# EAGLE schematic smash (EAGLE 6.3)

## Sheet 1 of 2
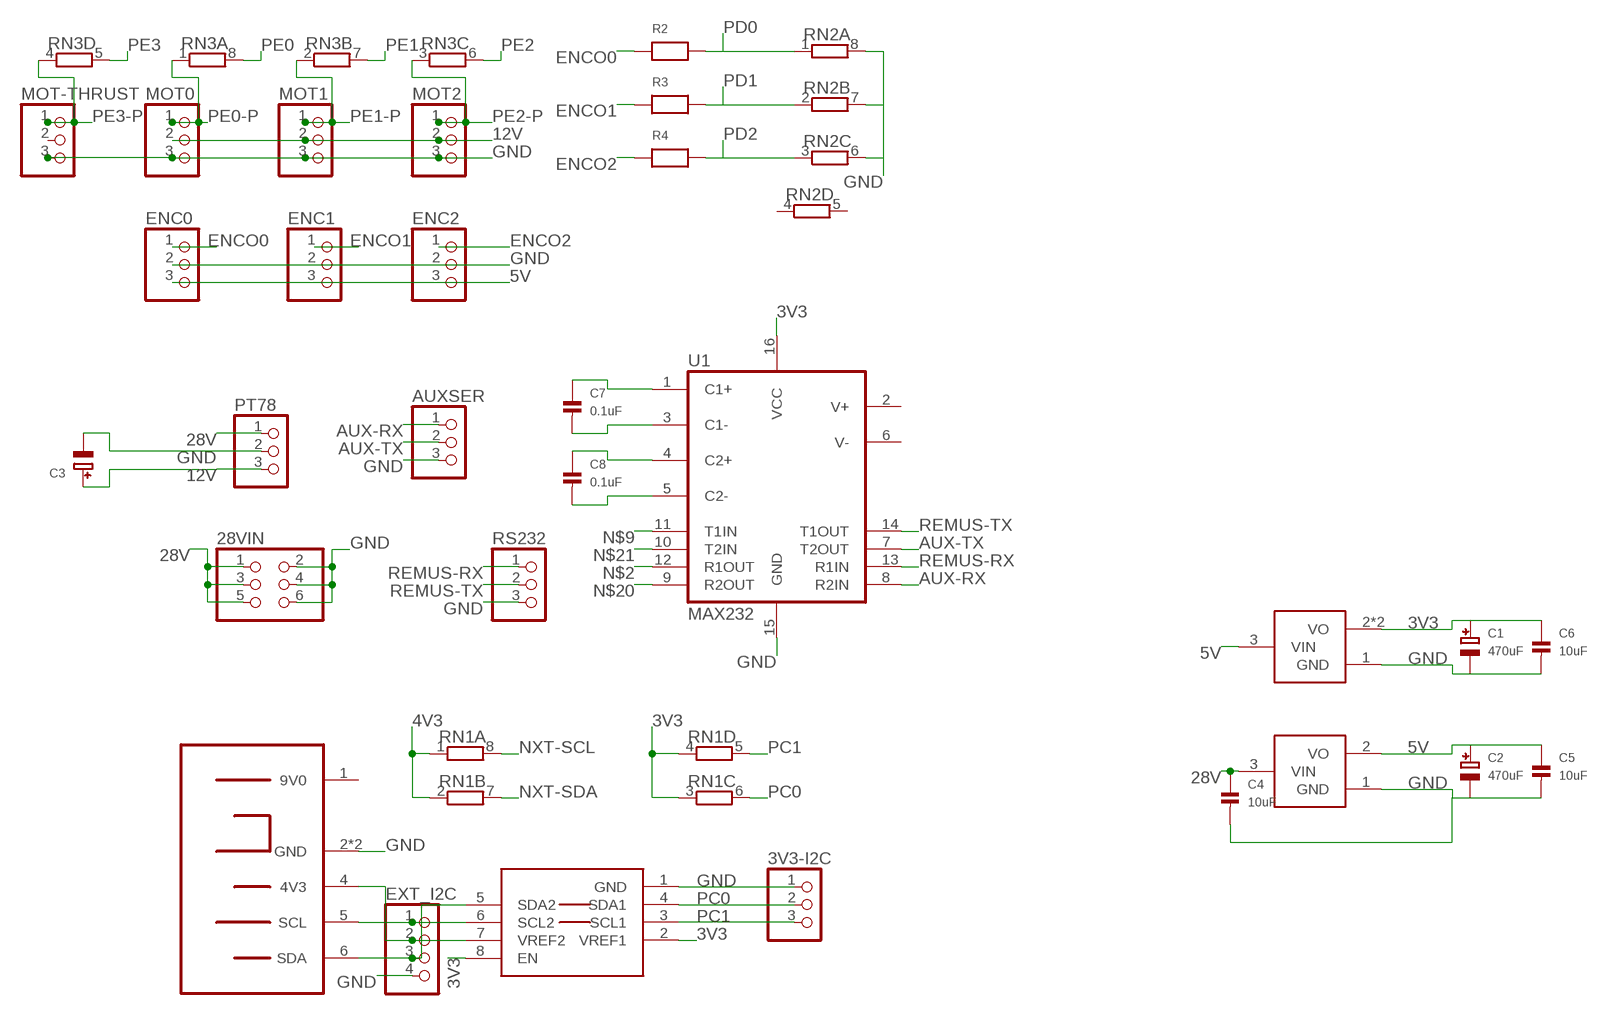
[diagram p0: schematic, sheet 1]

### Parts
3V3-I2C  HEADER-1X3ROUND  [1X03_ROUND]
28VIN  HEADER-2X3  [2X03]
AUXSER  HEADER-1X3ROUND  [1X03_ROUND]
C1  470uF  CAP_TANTALUMD/7343_WAVE  [EIA7343-31/D-W]
C2  470uF  CAP_TANTALUMD/7343_WAVE  [EIA7343-31/D-W]
C3  CAP_TANTALUMD/7343_WAVE  [EIA7343-31/D-W]
C4  10uF  CAP_CERAMIC1206  [1206]
C5  10uF  CAP_CERAMIC1206  [1206]
C6  10uF  CAP_CERAMIC1206  [1206]
C7  0.1uF  CAP_CERAMIC0603  [0603]
C8  0.1uF  CAP_CERAMIC0603  [0603]
ENC0  HEADER-1X3ROUND  [1X03_ROUND]
ENC1  HEADER-1X3ROUND  [1X03_ROUND]
ENC2  HEADER-1X3ROUND  [1X03_ROUND]
EXT_I2C  HEADER-1X4ROUND  [1X04_ROUND]
MOT0  HEADER-1X3ROUND  [1X03_ROUND]
MOT1  HEADER-1X3ROUND  [1X03_ROUND]
MOT2  HEADER-1X3ROUND  [1X03_ROUND]
MOT-THRUST  HEADER-1X3ROUND  [1X03_ROUND]
PT78  HEADER-1X3ROUND  [1X03_ROUND]
R2  RESISTOR0603  [0603]
R3  RESISTOR0603  [0603]
R4  RESISTOR0603  [0603]
RN1  RNETWORK  [RN8P-4R-CRA06S]
RN2  RNETWORK  [RN8P-4R-CRA06S]
RN3  RNETWORK  [RN8P-4R-CRA06S]
RS232  HEADER-1X3ROUND  [1X03_ROUND]
U1  MAX232  [SO-16]
U$1  PCA9306  [SO-08]
U$2  NXT-CONNECTOR  [NXT-FOOTPRINT]
U$3  VREGAP1117  [SOT223]
U$4  VREGIFX27001  [TO252]

### Nets
3V3: C1.+ C6.1 RN1.3 RN1.4 U1.16(VCC) U$1.2(VREF1) U$1.8(EN) U$3.2(VO) U$3.4(VO) ; also sheet 2
4V3: EXT_I2C.2 RN1.1 RN1.2 U$1.7(VREF2) U$2.4(4V3)
5V: C2.+ C5.1 ENC0.3 ENC1.3 ENC2.3 U$3.3(VIN) U$4.2(VO) ; also sheet 2
12V: C3.+ MOT0.2 MOT1.2 MOT2.2 PT78.3
28V: 28VIN.1 28VIN.3 28VIN.5 C4.1 PT78.1 U$4.3(VIN)
AUX-RX: AUXSER.1 U1.8(R2IN)
AUX-TX: AUXSER.2 U1.7(T2OUT)
C1+: C7.1 U1.1(C1+)
C1-: C7.2 U1.3(C1-)
C2+: C8.1 U1.4(C2+)
C2-: C8.2 U1.5(C2-)
ENCO0: ENC0.1 R2.1
ENCO1: ENC1.1 R3.1
ENCO2: ENC2.1 R4.1
GND: 3V3-I2C.1 28VIN.2 28VIN.4 28VIN.6 AUXSER.3 C1.- C3.- C4.2 C5.2 C6.2 ENC0.2 ENC1.2 ENC2.2 EXT_I2C.4 MOT0.3 MOT1.3 MOT2.3 MOT-THRUST.3 PT78.2 RN2.6 RN2.7 RN2.8 RS232.3 U1.15(GND) U$1.1(GND) U$2.2(GND) U$2.3(GND) U$3.1(GND) U$4.1(GND) ; also sheet 2
N$2: U1.12(R1OUT)
N$9: U1.11(T1IN)
N$20: U1.9(R2OUT)
N$21: U1.10(T2IN)
NXT-SCL: EXT_I2C.1 RN1.8 U$1.6(SCL2) U$2.5(SCL)
NXT-SDA: EXT_I2C.3 RN1.7 U$1.5(SDA2) U$2.6(SDA)
PC0: 3V3-I2C.2 RN1.6 U$1.4(SDA1) ; also sheet 2
PC1: 3V3-I2C.3 RN1.5 U$1.3(SCL1) ; also sheet 2
PD0: R2.2 RN2.1 ; also sheet 2
PD1: R3.2 RN2.2 ; also sheet 2
PD2: R4.2 RN2.3 ; also sheet 2
PE0: RN3.8 ; also sheet 2
PE0-P: MOT0.1 RN3.1
PE1: RN3.7 ; also sheet 2
PE1-P: MOT1.1 RN3.2
PE2: RN3.6 ; also sheet 2
PE2-P: MOT2.1 RN3.3
PE3: RN3.5 ; also sheet 2
PE3-P: MOT-THRUST.1 RN3.4
REMUS-RX: RS232.1 U1.13(R1IN)
REMUS-TX: RS232.2 U1.14(T1OUT)
Unconnected: C2.- MOT-THRUST.2 RN2.4 RN2.5 U1.2(V+) U1.6(V-) U$2.1(9V0)

## Sheet 2 of 2
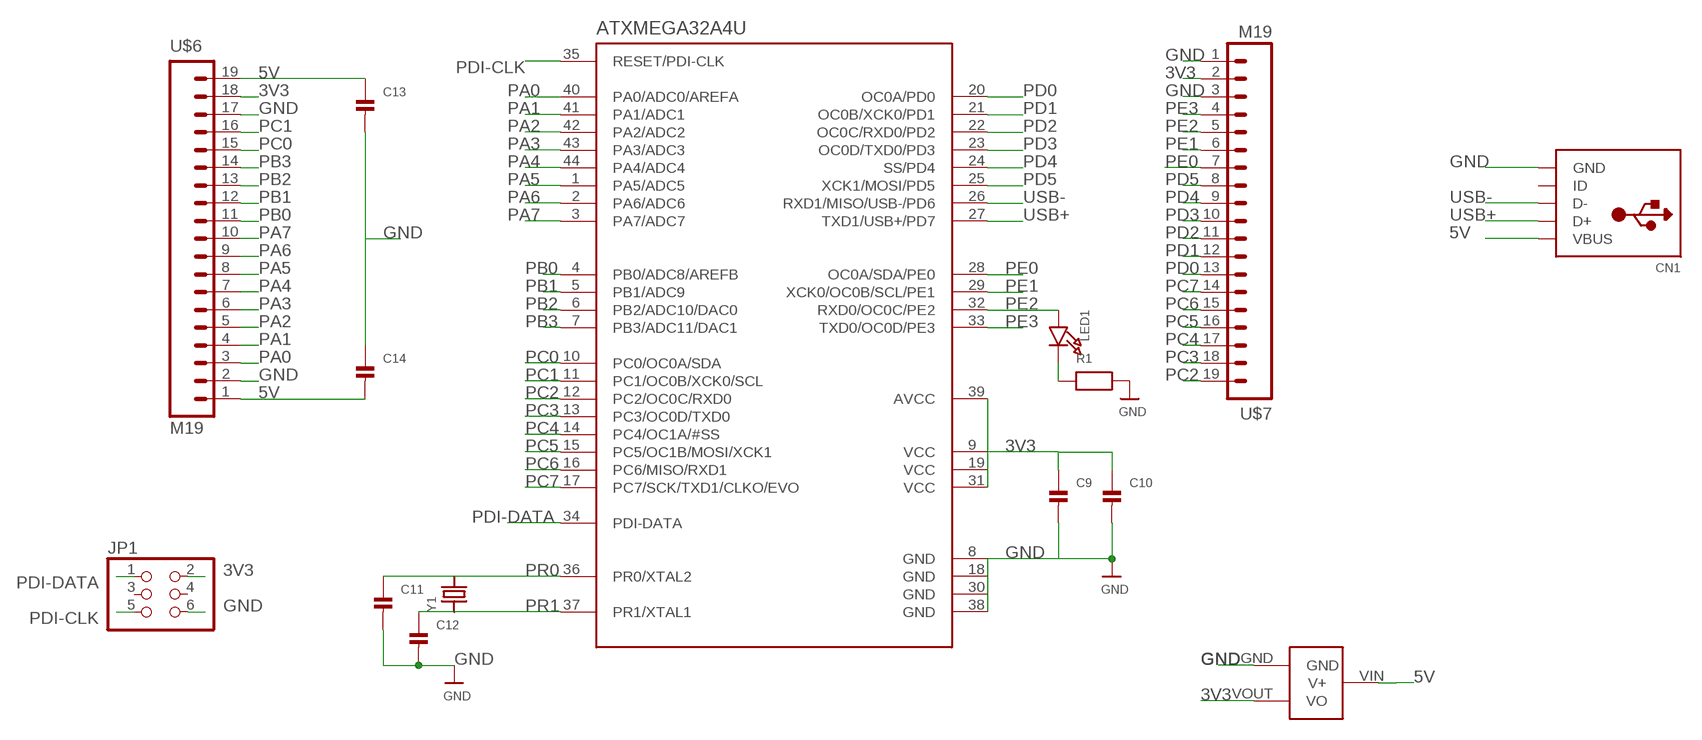
[diagram p1: schematic, sheet 2]

### Parts
ATXMEGA32A4U  ATXMEGAXXA4U-AU  [TQFP-44]
C9  CAP_CERAMIC0603  [0603]
C10  CAP_CERAMIC0603  [0603]
C11  CAP_CERAMIC0603  [0603]
C12  CAP_CERAMIC0603  [0603]
C13  CAP_CERAMIC0603  [0603]
C14  CAP_CERAMIC0603  [0603]
CN1  USBMICROB  [USB-MICROB]
JP1  HEADER-2X3  [2X03]
LED1  LED0603  [CHIPLED_0603]
R1  RESISTOR0603  [0603]
U$5  MCP1700  [SOT23-3]
U$6  M19  [1X19]
U$7  M19  [1X19]
Y1  CRYSTAL  [NX8045GB]

### Nets
3V3: ATXMEGA32A4U.9(VCC) ATXMEGA32A4U.19(VCC) ATXMEGA32A4U.31(VCC) ATXMEGA32A4U.39(AVCC) C9.1 C10.1 JP1.2 U$5.VOUT(VO) U$6.18 U$7.2 ; also sheet 1
5V: C13.1 C14.2 CN1.P1(VBUS) U$5.VIN(V+) U$6.1 U$6.19 ; also sheet 1
GND: ATXMEGA32A4U.8(GND) ATXMEGA32A4U.18(GND) ATXMEGA32A4U.30(GND) ATXMEGA32A4U.38(GND) C9.2 C10.2 C11.2 C12.2 C13.2 C14.1 CN1.P5(GND) JP1.6 R1.2 U$5.GND U$6.2 U$6.17 U$7.1 U$7.3 ; also sheet 1
N$6: LED1.C R1.1
PA0: ATXMEGA32A4U.40(PA0/ADC0/AREFA) U$6.3
PA1: ATXMEGA32A4U.41(PA1/ADC1) U$6.4
PA2: ATXMEGA32A4U.42(PA2/ADC2) U$6.5
PA3: ATXMEGA32A4U.43(PA3/ADC3) U$6.6
PA4: ATXMEGA32A4U.44(PA4/ADC4) U$6.7
PA5: ATXMEGA32A4U.1(PA5/ADC5) U$6.8
PA6: ATXMEGA32A4U.2(PA6/ADC6) U$6.9
PA7: ATXMEGA32A4U.3(PA7/ADC7) U$6.10
PB0: ATXMEGA32A4U.4(PB0/ADC8/AREFB) U$6.11
PB1: ATXMEGA32A4U.5(PB1/ADC9) U$6.12
PB2: ATXMEGA32A4U.6(PB2/ADC10/DAC0) U$6.13
PB3: ATXMEGA32A4U.7(PB3/ADC11/DAC1) U$6.14
PC0: ATXMEGA32A4U.10(PC0/OC0A/SDA) U$6.15 ; also sheet 1
PC1: ATXMEGA32A4U.11(PC1/OC0B/XCK0/SCL) U$6.16 ; also sheet 1
PC2: ATXMEGA32A4U.12(PC2/OC0C/RXD0) U$7.19
PC3: ATXMEGA32A4U.13(PC3/OC0D/TXD0) U$7.18
PC4: ATXMEGA32A4U.14(PC4/OC1A/#SS) U$7.17
PC5: ATXMEGA32A4U.15(PC5/OC1B/MOSI/XCK1) U$7.16
PC6: ATXMEGA32A4U.16(PC6/MISO/RXD1) U$7.15
PC7: ATXMEGA32A4U.17(PC7/SCK/TXD1/CLKO/EVO) U$7.14
PD0: ATXMEGA32A4U.20(OC0A/PD0) U$7.13 ; also sheet 1
PD1: ATXMEGA32A4U.21(OC0B/XCK0/PD1) U$7.12 ; also sheet 1
PD2: ATXMEGA32A4U.22(OC0C/RXD0/PD2) U$7.11 ; also sheet 1
PD3: ATXMEGA32A4U.23(OC0D/TXD0/PD3) U$7.10
PD4: ATXMEGA32A4U.24(SS/PD4) U$7.9
PD5: ATXMEGA32A4U.25(XCK1/MOSI/PD5) U$7.8
PDI-CLK: ATXMEGA32A4U.35(RESET/PDI-CLK) JP1.5
PDI-DATA: ATXMEGA32A4U.34(PDI-DATA) JP1.1
PE0: ATXMEGA32A4U.28(OC0A/SDA/PE0) U$7.7 ; also sheet 1
PE1: ATXMEGA32A4U.29(XCK0/OC0B/SCL/PE1) U$7.6 ; also sheet 1
PE2: ATXMEGA32A4U.32(RXD0/OC0C/PE2) LED1.A U$7.5 ; also sheet 1
PE3: ATXMEGA32A4U.33(TXD0/OC0D/PE3) U$7.4 ; also sheet 1
PR0: ATXMEGA32A4U.36(PR0/XTAL2) C11.1 Y1.P$2
PR1: ATXMEGA32A4U.37(PR1/XTAL1) C12.1 Y1.P$1
USB+: ATXMEGA32A4U.27(TXD1/USB+/PD7) CN1.P3(D+)
USB-: ATXMEGA32A4U.26(RXD1/MISO/USB-/PD6) CN1.P2(D-)
Unconnected: CN1.P4(ID) JP1.3 JP1.4

## Library data of the parts
3V3-I2C AUXSER ENC0 ENC1 ENC2 MOT0 MOT1 MOT2 MOT-THRUST PT78 RS232 = nonolith:HEADER-1X3: PIN HEADER
28VIN JP1 = nonolith:HEADER-2X3: PIN HEADER
ATXMEGA32A4U = nonolith:ATXMEGAXXA4U: ATXMEGA A4U Series (XMEGA+USB)
C1-C3 = microbuilder:CAP_TANTALUM: Tantalum Capacitors Wave footprints have larger pads and are meant to be used for hand soldering. Reflow footprints are optimised for solder paste and a reflow oven. EIA3216-18/A-[R/W] - Size A / 3216-18 / 1206 footprint 4.7µF 25V 10% Tantalum Capacitor 10µF 16V 10% Tantalum Capacitor [Digikey: 495-2236-2-ND] EIA3528-21/B-[R/W] - Size B / 3528-21 47µF 10V 10% Tantalum Capactior [Digikey: 495-2216-1-ND] EIA6032-28/C-[R/W] - Size C / 6032-28 10µF 35V 20% Tantalum Capacitor [Digikey: 495-2285-1-ND] 100µF 16V 10% Tantalum Capactior [Digikey: 399-5214-1-ND]
C4-C14 = nonolith:CAP_CERAMIC: Ceramic Capacitors 0402 - 0402 Surface Mount Capacitors 0.1uF 10V 10% [Digikey: 490-1318-2-ND] 0603 - 0603 Surface Mount Capacitors 16 pF 50V 5% [Digikey: 445-5051-2-ND] 22 pF 50V [Digikey: PCC220ACVTR-ND] 33 pF 50V 5% [Digikey: 490-1415-1-ND] 56pF 50V 5% [Digikey: 490-1421-1-ND] 220pF 50V 5% [Digikey: 445-1285-1-ND] 680 pF 50V 2200 pF 50V 5% C0G [Digikey: 445-1297-1-ND] 5600 pF 100V 5% X7R [Digikey: 478-3711-1-ND] 0.1 µF 25V 10% [Digikey: PCC2277TR-ND] 0.22 µF 16V 10% X7R [Digikey: 445-1318-1-ND] 1.0 µF 25V 10% [Digikey: 445-5146-2-ND] 0603 - RF Specific 3pF 250V +/-0.1pF RF [Digikey: 712-1347-1-ND] 18 pF 250V 5% [Digikey: 478-3505-1-ND or 712-1322-1-ND] 56 pF 250V 5% C0G RF [Digikey: 490-4867-1-ND] 68 pF 250V RF [Digikey: 490-4868-1-ND] 0805 - 0805 Surface Mount Capacitors 220 pF 250V 2% RF Ceramic Capacitor [Digikey: 712-1398-1-ND] 1000 pF 50V 2% NP0 Ceramic Capacitor [Digikey: 478-3760-1-ND] 0.1 µF 25V 10% Ceramic Capacitor [Digikey: PCC1828TR-ND] 1.0 µF 16V 10% Ceramic Capacitor[Digikey: 490-1691-2-ND] 10.0 µF 10V 10% Ceramic Capacitor[Digikey: 709-1228-1-ND] 1206 - 1206 Surface Mount Capacitors
CN1 = nonolith:USB: USB Connectors USBMINIB - Surface Mount Female Mini-B USB Connector 4UConnector: 06564 By microbuilder.eu
EXT_I2C = nonolith:HEADER-1X4: PIN HEADER
LED1 = microbuilder:LED: LED 0603 - 0603 Surface Mount Package 2mA: Green LED - Low Power (3.9mcd, 2ma, 1.7Vf) - Digikey: 475-2709-2-ND Orange LED - Low Power (9.8mcd, 2ma, 1.8Vf) - Digikey: 475-1194-2-ND Red LED - Low Power (5mcd, 2ma, 1.8Vf) - Digikey: 475-1195-2-ND Yellow LED - Low Power (7mcd, 2ma, 1.8Vf) - Digikey: 475-1196-2-ND 5mA: Blue LED - Low Power (17mcd, 5ma, 2.9Vf) - Digikey: LNJ937W8CRACT-ND 0805 - 0805 Surface Mount Package 2mA: Red LED (8.8mcd, 2mA, 1.8Vf, Clear) - Low Power [Digikey: 475-2510-1-ND] Green LED (5mcd, 2mA, 1.8Vf, Clear) - Low Power [Digikey: 475-2730-1-ND] Yellow LED (11.3mcd, 2mA, 1.8Vf, Clear) - Low Power [Digikey: 475-2555-1-ND] 20mA: Red LED (104mcd, 20mA, Diffused) - LS R976 [Digikey: 475-1278-6-ND] Red LED (12mcd, 20mA, 2.0Vf, Clear) - APT2012EC [Digikey: 754-1128-1-ND] Green LED (15mcd, 20mA, 2.2Vf, Clear) - APT2012GC [Digikey: 754-1131-1-ND] Orange LED (160mcd, 20mA, 2.1Vf, Clear) - APT2012SECK [Digikey: 754-1130-1-ND] 1206 - 1206 Surface Mount Package Green LED (26mcd, 20mA, Diffused) - LG N971 [Digikey: 475-1407-6-ND] Red LED (15mcd, 20mA, Diffused) - LH N974 [Digikey: 475-1416-6-ND]
R1-R4 = nonolith:RESISTOR: Resistors 0402 - 0402 Surface Mount Package 10.0K 1% 1/16W [Digikey: 311-10.0KLRTR-ND] 0603 - 0603 Surface Mount Package 0 Ohm 1/10 Watt 1% Resistor 15 Ohm 1/10 Watt 1% Resistor 33 Ohm 1/10 Watt 1% Resistor 49.9 Ohm 1/10 Watt 1% Resistor 100 Ohm 1/10 Watt 1% Resistor 150 Ohm 1/10 Watt 1% Resistor 240 Ohm 1/10 Watt 1% Resistor 390 Ohm 1/10 Watt 1% Resistor 560 Ohm 1/10 Watt 1% Resistor 750 Ohm 1/10 Watt 1% Resistor 1.0K Ohm 1/10 Watt 1% Resistor 1.5K Ohm 1/10 Watt 1% Resistor 2.0K Ohm 1/10 Watt 1% Resistor 4.7K Ohm 1/10 Watt 1% Resistor 10.0K Ohm 1/10 Watt 1% Resistor 20.0K Ohm 1/10 Watt 1% Resistor 33.0K Ohm 1/10 Watt 1% Resistor 100.0K Ohm 1/10 Watt 1% Resistor 0805 - 0805 Surface Mount Package 0 Ohm 1/8 Watt 1% Resistor 33 Ohm 1/8 Watt 1% Resistor 100 Ohm 1/8 Watt 1% Resistor 150 Ohm 1/8 Watt 1% Resistor 200 Ohm 1/8 Watt 1% Resistor 240 Ohm 1/8 Watt 1% Resistor 330 Ohm 1/8 Watt 1% Resistor 390 Ohm 1/8 Watt 1% Resistor 470 Ohm 1/8 Watt 1% Resistor 1.0K Ohm 1/8 Watt 1% Resistor 1.5K Ohm 1/8 Watt 1% Resistor 2.0K Ohm 1/8 Watt 1% Resistor 4.7K Ohm 1/8 Watt 1% Resistor 5.1K Ohm 1/8 Watt 1% Resistor 5.6K Ohm 1/8 Watt 1% Resistor 10.0K Ohm 1/8 Watt 1% Resistor 22.0K Ohm 1/8 Watt 1% Resistor 33.0K Ohm 1/8 Watt 1% Resistor 100K Ohm 1/8 Watt 1% Resistor 1206 - 1206 Surface Mount Package
RN1-RN3 = nonolith:RNETWORK: 4 Resistor Array 0603
U1 = nonolith:MAX232: RS232 Transceiver SN75C3232 MAX[3]232
U$1 = nonolith:PCA9306: Bidirectional I2C level shifter. NOT compatible with all available part number pinout schemes- DOUBLE CHECK!!!
U$2 = nonolith:NXT-CONNECTOR
U$3 U$4 = nonolith:VREG
U$5 = nonolith:MCP1700: Voltage regulator
U$6 U$7 = SparkFun:M19
Y1 = nonolith:CRYSTAL: Crystals HC49UP - Surface Mount Crystal 4.0MHz 18pF +/-30ppm Surface Mount Crystal [Digikey: 535-9857-1-ND] 12.0 MHz Surface Mount Crystal [Digikey: 535-9869-6-ND] 25.0 MHz Surface Mount Crystal [Digikey: 535-9078-1-ND] 3.2 x 2.5mm - MEMs SMT Crystal 12.0 MHz 8pF 15ppm 3.2 x 2.5mm Crystal [Digikey: 644-1047-1-ND] 16.0 MHz 8pF 15ppm 3.2 x 2.5mm Crystal [Digikey: 644-1049-1-ND] 16.0 MHz 10pF 10ppm 3.2 x 2.5mm Crystal [Digikey: 644-1100-1-ND] 27.12 MHz 18pF 30ppm 3.2 x 2.5mm Crystal [Digikey: 887-1424-1-ND] 4.9 x 1.8mm - MEMs SMT Crystal 32.768 KHz 12.5pF 20ppm 4.9 x 1.8mm Crystal [Digikey: SE2415CT-ND] Cylinder 32.768KHz Cylinder Crystal

## Net classes
0 default: width 0.203 mm, clearance 0.152 mm